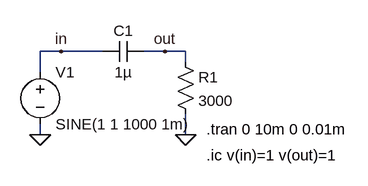
[diagram p0: schematic rc_highpass.asc]
rc_highpass.asc, the LTspice schematic file:
Version 4
SHEET 1 880 680
WIRE 96 144 64 144
WIRE 160 144 96 144
WIRE 256 144 224 144
WIRE 288 144 256 144
WIRE 288 160 288 144
WIRE 64 176 64 144
WIRE 64 272 64 256
WIRE 288 272 288 240
FLAG 288 272 0
FLAG 64 272 0
FLAG 256 144 out
FLAG 96 144 in
SYMBOL res 272 144 R0
SYMATTR InstName R1
SYMATTR Value 3000
SYMBOL cap 160 160 R270
WINDOW 0 32 32 VTop 2
WINDOW 3 0 32 VBottom 2
SYMATTR InstName C1
SYMATTR Value 1µ
SYMBOL voltage 64 160 R0
WINDOW 123 0 0 Left 2
WINDOW 39 0 0 Left 2
SYMATTR InstName V1
SYMATTR Value SINE(1 1 1000 1m)
TEXT 320 264 Left 2 !.tran 0 10m 0 0.01m
TEXT 320 304 Left 2 !.ic v(in)=1 v(out)=1

The netlist it stands for:
* rc_highpass.asc
R1 out 0 3000
C1 in out 1µ
V1 in 0 SINE(1 1 1000 1m)
.tran 0 10m 0 0.01m
.ic v(in)=1 v(out)=1
.backanno
.end